# Altium project tetris.PrjPcb
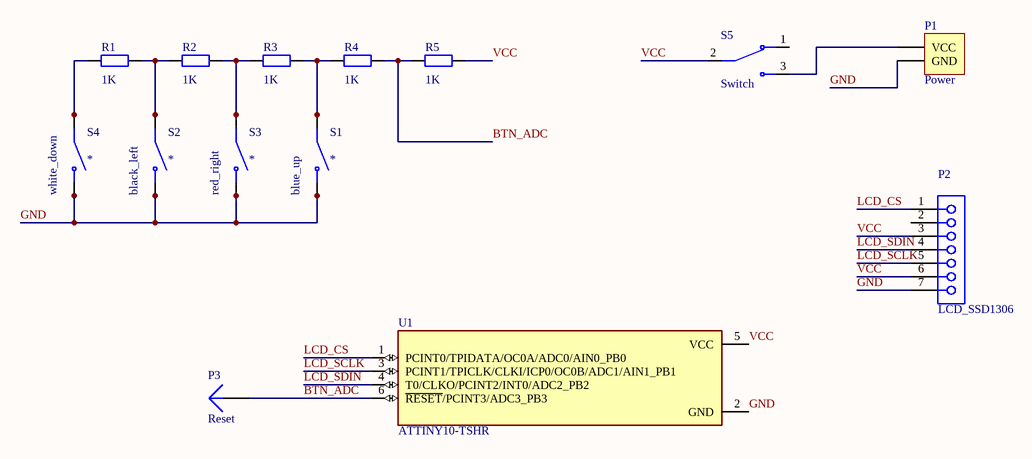
[diagram p0: tetris.SchDoc]
1 sheet, 14 parts. Net scope: global (net labels, ports and power ports of the same name join across sheets).
Board file: tetris.PcbDoc

## Sheet tetris.SchDoc
size A

### Parts
P1  Power  [HDR1X2]
P2  LCD_SSD1306  [61300711821]
P3  Reset  [PIN1]
R1  1K  [AXIAL-0.4]
R2  1K  [AXIAL-0.4]
R3  1K  [AXIAL-0.4]
R4  1K  [AXIAL-0.4]
R5  1K  [AXIAL-0.4]
S1  blue_up  [SW_1571627-1]
S2  black_left  [SW_1571627-1]
S3  red_right  [SW_1571627-1]
S4  white_down  [SW_1571627-1]
S5  Switch  [SW_EG1270]
U1  ATTINY10-TSHR  [SOT95P280X145-6N]

### Nets
BTN_ADC: P3.1 R4.2 R5.1 U1.6(~{RESET}/PCINT3/ADC3_PB3)
GND: P1.2(GND) P2.7 S1.3(NO) S1.4(NO) S2.3(NO) S2.4(NO) S3.3(NO) S3.4(NO) S4.3(NO) S4.4(NO) U1.2(GND)
LCD_CS: P2.1 U1.1(PCINT0/TPIDATA/OC0A/ADC0/AIN0_PB0)
LCD_SCLK: P2.5 U1.3(PCINT1/TPICLK/CLKI/ICP0/OC0B/ADC1/AIN1_PB1)
LCD_SDIN: P2.4 U1.4(T0/CLKO/PCINT2/INT0/ADC2_PB2)
VCC: P2.3 P2.6 R5.2 S5.2 U1.5(VCC)
NetP1_1: P1.1(VCC) S5.3
NetR1_1: R1.1 S4.1(COM) S4.2(COM)
NetR1_2: R1.2 R2.1 S2.1(COM) S2.2(COM)
NetR2_2: R2.2 R3.1 S3.1(COM) S3.2(COM)
NetR3_2: R3.2 R4.1 S1.1(COM) S1.2(COM)

Not connected (* = marked no-connect by the designer): P2 2; S5 1

### Library data of the parts
P1 = Header 2: Header, 2-Pin; LatestRevisionDate: 17-Jul-2002; LatestRevisionNote: Re-released for DXP Platform.; Publisher: Altium Limited
P2 = 61300711821: WR-PHD Socket Header, THT, Vertical, pitch 2.54mm, 1 Row, 7P; Manufacturer: Wurth Elektronik; Contact Resistance: 20mOhm; Rated Current: 3A; Working Voltage: 250V; Withstanding Voltage: 500V; Manufacturer Part Number: 61300711821; Category: Board-to-Board Connectors; Match Code: WR-PHD; ComponentLink1Description: Website Link; ComponentLink1URL: https://www.we-online.com/redexpert/article/61300711821?ad; ComponentLink2Description: Datasheet Link; ComponentLink2URL: https://www.we-online.com/redexpert/spec/61300711821?ad; Mount: Through Hole; Operating Temperature Max: 125°C; Operating Temperature Min: -40°C; Packaging: Tray; Gender: Socket Header; Number of Pins: 7; Number of Rows: 1; Orientation: Vertical; Pitch: 2.54mm
P3 = Plug: LatestRevisionDate: 17-Jul-2002; LatestRevisionNote: Re-released for DXP Platform.; Publisher: Altium Limited
R1-R5 = Res2: Resistor; Published: 8-Jun-2000; LatestRevisionDate: 17-Jul-2002; LatestRevisionNote: Re-released for DXP Platform.; PackageReference: AXIAL-0.4; Publisher: Altium Limited; PackageDescription: Axial Device, Thru-Hole; 2 Leads; 0.4 in Pin Spacing; Value: 1K
S1-S4 = FSM103A: Switch Tactile OFF (ON) SPST Extended Square Button PC Pins 0.05A 12VDC 2.55N Thru-Hole Loose Piece; MF: TE Connectivity; SnapEDA_Link: https://www.snapeda.com/parts/FSM103A/TE%20Connectivity%20ALCOSWITCH%20Switches/view-part/577644/?ref=snap; Purchase-URL: https://pricing.snapeda.com/search/part/FSM103A/?ref=eda; Availability: In Stock; Value: *; Check_prices: https://www.snapeda.com/parts/FSM103A/TE%20Connectivity%20ALCOSWITCH%20Switches/view-part/577644/?ref=eda; Package: None; Price: None; MP: FSM103A; Comment_1: *
S5 = EG1270: Slide Switch SPDT Through Hole, Right Angle; MF: E-Switch; Availability: In Stock; Check_prices: https://www.snapeda.com/parts/EG1270/E-Switch/view-part/?ref=eda; SnapEDA_Link: https://www.snapeda.com/parts/EG1270/E-Switch/view-part/?ref=snap; Purchase-URL: https://pricing.snapeda.com/search/part/EG1270/?ref=eda; Package: None; MP: EG1270; Value: *; Price: None
U1 = ATTINY10-TSHR: AVR AVR® ATtiny Microcontroller IC 8-Bit 12MHz 1KB (512 x 16) FLASH SOT-23-6; MF: Microchip; SnapEDA_Link: https://www.snapeda.com/parts/ATTINY10-TSHR/Microchip/view-part/?ref=snap; Package: SOT-23-6 Microchip; Value: *; MP: ATTINY10-TSHR; Check_prices: https://www.snapeda.com/parts/ATTINY10-TSHR/Microchip/view-part/?ref=eda